# EAGLE schematic Adafruit Speaker Bonnet (EAGLE 6.4)
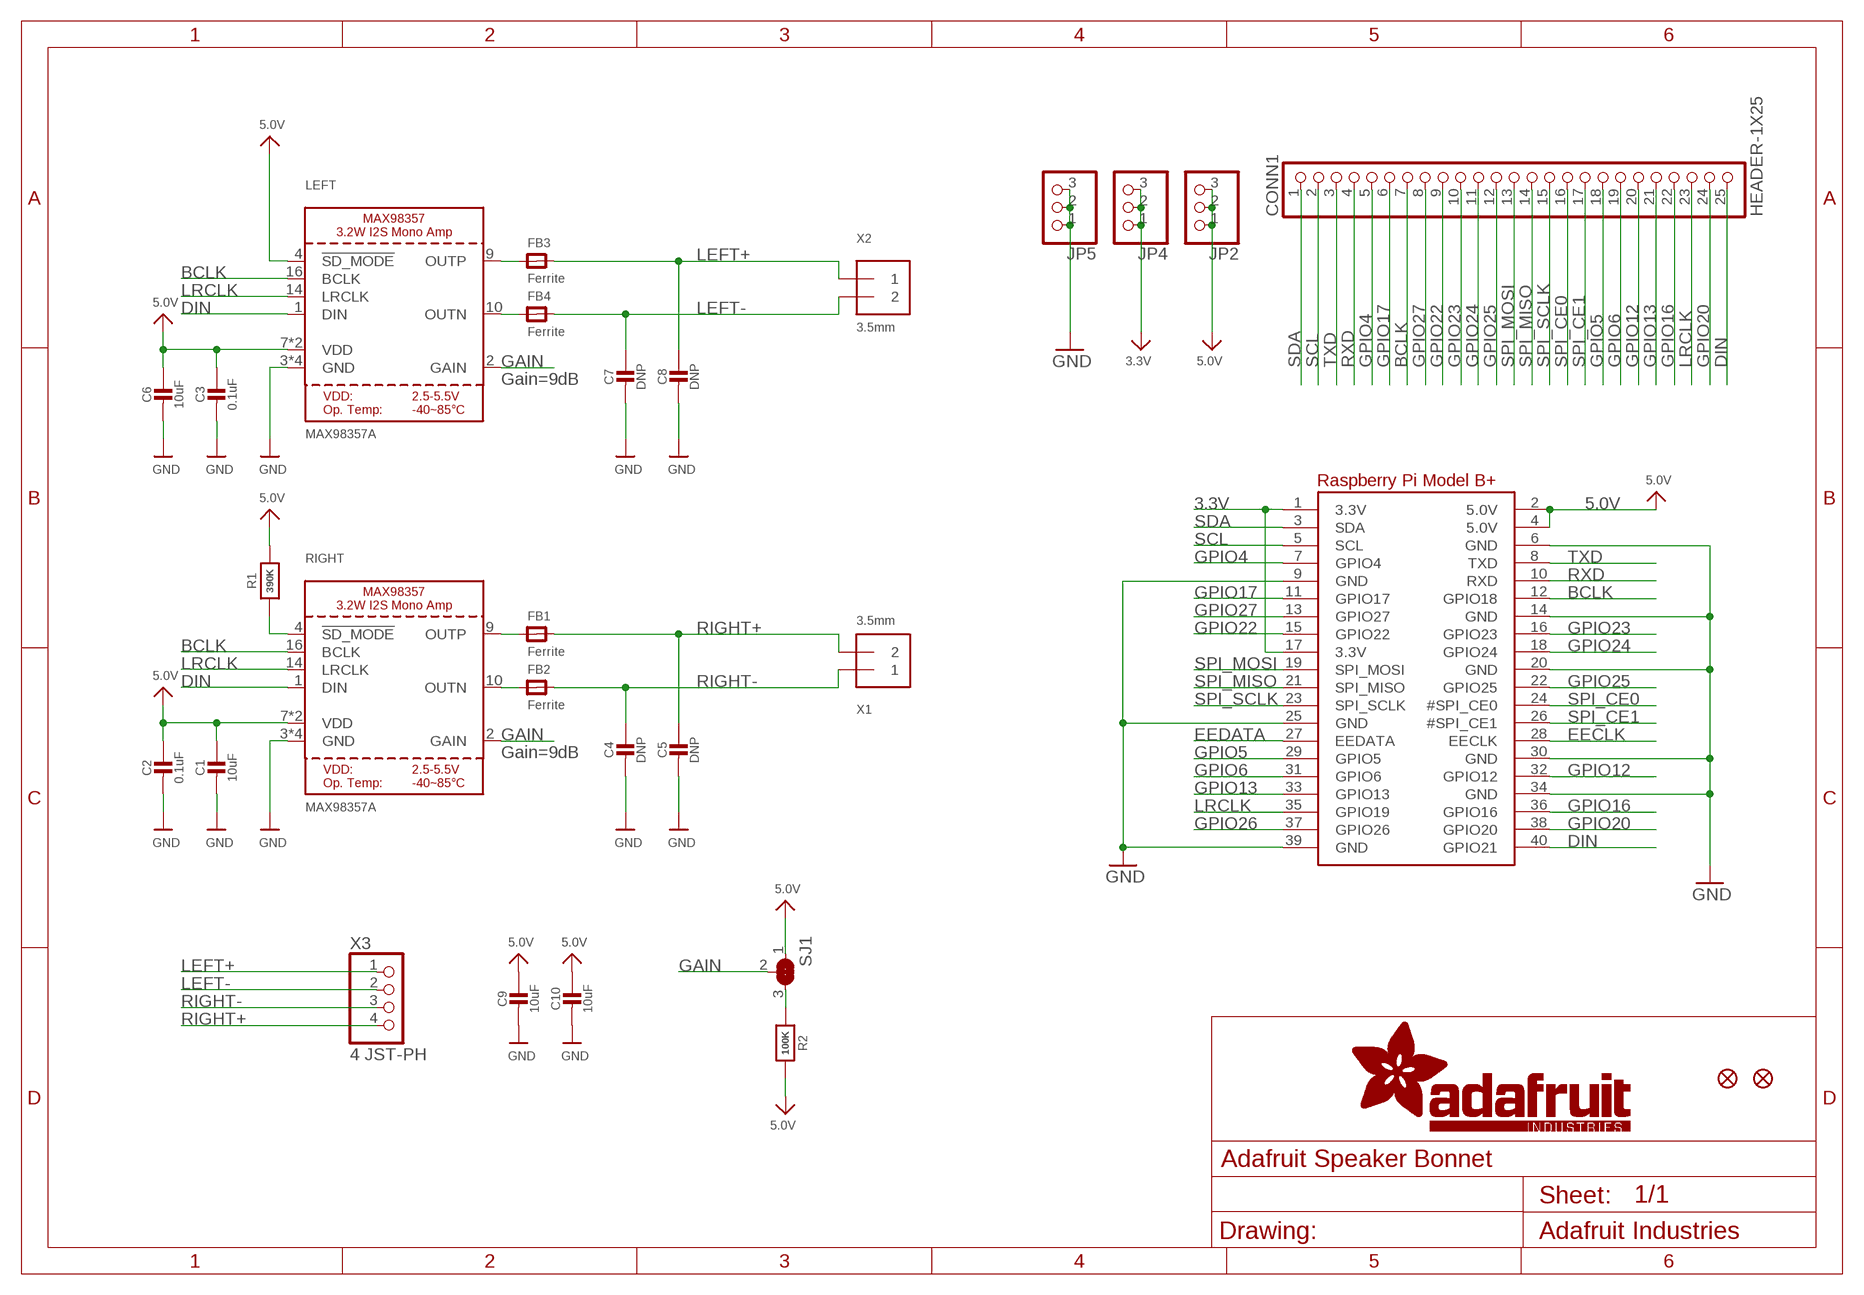
[diagram p0: schematic, sheet 1]

## Parts
C1  10uF  CAP_CERAMIC0805-NOOUTLINE  [0805-NO]
C2  0.1uF  CAP_CERAMIC0805-NOOUTLINE  [0805-NO]
C3  0.1uF  CAP_CERAMIC0805-NOOUTLINE  [0805-NO]
C4  DNP  CAP_CERAMIC0805-NOOUTLINE  [0805-NO]
C5  DNP  CAP_CERAMIC0805-NOOUTLINE  [0805-NO]
C6  10uF  CAP_CERAMIC0805-NOOUTLINE  [0805-NO]
C7  DNP  CAP_CERAMIC0805-NOOUTLINE  [0805-NO]
C8  DNP  CAP_CERAMIC0805-NOOUTLINE  [0805-NO]
C9  10uF  CAP_CERAMIC0805-NOOUTLINE  [0805-NO]
C10  10uF  CAP_CERAMIC0805-NOOUTLINE  [0805-NO]
CONN1  HEADER-1X25  [1X25_ROUND_70MIL]
FB1  Ferrite  FERRITE-0805NO  [0805-NO]
FB2  Ferrite  FERRITE-0805NO  [0805-NO]
FB3  Ferrite  FERRITE-0805NO  [0805-NO]
FB4  Ferrite  FERRITE-0805NO  [0805-NO]
FID1  FIDUCIAL""  [FIDUCIAL_1MM]
FID2  FIDUCIAL""  [FIDUCIAL_1MM]
JP2  HEADER-1X376MIL  [1X03_ROUND_76]
JP4  HEADER-1X376MIL  [1X03_ROUND_76]
JP5  HEADER-1X376MIL  [1X03_ROUND_76]
LEFT  MAX98357A  AUDIOAMP_MAX98357  [QFN16_3MM]
R1  390K  RESISTOR0805_NOOUTLINE  [0805-NO]
R2  100K  RESISTOR0805_NOOUTLINE  [0805-NO]
RIGHT  MAX98357A  AUDIOAMP_MAX98357  [QFN16_3MM]
RPI1  RASPBERRYPI_BPLUS_BONNETNODIM  [PI_BONNET_NODIM]
SJ1  SOLDERJUMPER_2WAY  [SOLDERJUMPER_2WAY_OPEN_NOPASTE]
X1  3.5mm  TERMBLOCK_1X2  [TERMBLOCK_1X2-3.5MM]
X2  3.5mm  TERMBLOCK_1X2  [TERMBLOCK_1X2-3.5MM]
X3  4 JST-PH  CON_JST_PH_4PIN  [JSTPH4]

## Nets
3.3V: JP4.1 JP4.2 JP4.3 RPI1.1(3.3V) RPI1.17(3.3V)
5.0V: C1.1 C2.1 C3.1 C6.1 C9.1 C10.1 JP2.1 JP2.2 JP2.3 LEFT.4(!SD_MODE) LEFT.7(VDD) LEFT.8(VDD) R1.2 R2.2 RIGHT.7(VDD) RIGHT.8(VDD) RPI1.2(5.0V) RPI1.4(5.0V) SJ1.1
BCLK: CONN1.7 LEFT.16(BCLK) RIGHT.16(BCLK) RPI1.12(GPIO18)
DIN: CONN1.25 LEFT.1(DIN) RIGHT.1(DIN) RPI1.40(GPIO21)
EECLK: RPI1.28(EECLK)
EEDATA: RPI1.27(EEDATA)
GAIN: LEFT.2(GAIN) RIGHT.2(GAIN) SJ1.2
GND: C1.2 C2.2 C3.2 C4.2 C5.2 C6.2 C7.2 C8.2 C9.2 C10.2 JP5.1 JP5.2 JP5.3 LEFT.3(GND) LEFT.11(GND) LEFT.15(GND) LEFT.THERMAL(GND) RIGHT.3(GND) RIGHT.11(GND) RIGHT.15(GND) RIGHT.THERMAL(GND) RPI1.6(GND) RPI1.9(GND) RPI1.14(GND) RPI1.20(GND) RPI1.25(GND) RPI1.30(GND) RPI1.34(GND) RPI1.39(GND)
GPIO4: CONN1.5 RPI1.7(GPIO4)
GPIO5: CONN1.18 RPI1.29(GPIO5)
GPIO6: CONN1.19 RPI1.31(GPIO6)
GPIO12: CONN1.20 RPI1.32(GPIO12)
GPIO13: CONN1.21 RPI1.33(GPIO13)
GPIO16: CONN1.22 RPI1.36(GPIO16)
GPIO17: CONN1.6 RPI1.11(GPIO17)
GPIO20: CONN1.24 RPI1.38(GPIO20)
GPIO22: CONN1.9 RPI1.15(GPIO22)
GPIO23: CONN1.10 RPI1.16(GPIO23)
GPIO24: CONN1.11 RPI1.18(GPIO24)
GPIO25: CONN1.12 RPI1.22(GPIO25)
GPIO26: RPI1.37(GPIO26)
GPIO27: CONN1.8 RPI1.13(GPIO27)
LEFT+: C8.1 FB3.2 X2.1 X3.1
LEFT-: C7.1 FB4.2 X2.2 X3.2
LRCLK: CONN1.23 LEFT.14(LRCLK) RIGHT.14(LRCLK) RPI1.35(GPIO19)
N$1: FB4.1 LEFT.10(OUTN)
N$2: FB3.1 LEFT.9(OUTP)
N$5: FB2.1 RIGHT.10(OUTN)
N$6: FB1.1 RIGHT.9(OUTP)
N$7: R2.1 SJ1.3
RIGHT+: C5.1 FB1.2 X1.2 X3.4
RIGHT-: C4.1 FB2.2 X1.1 X3.3
RXD: CONN1.4 RPI1.10(RXD)
SCL: CONN1.2 RPI1.5(SCL)
SD_MODE: R1.1 RIGHT.4(!SD_MODE)
SDA: CONN1.1 RPI1.3(SDA)
SPI_CE0: CONN1.16 RPI1.24(#SPI_CE0)
SPI_CE1: CONN1.17 RPI1.26(#SPI_CE1)
SPI_MISO: CONN1.14 RPI1.21(SPI_MISO)
SPI_MOSI: CONN1.13 RPI1.19(SPI_MOSI)
SPI_SCLK: CONN1.15 RPI1.23(SPI_SCLK)
TXD: CONN1.3 RPI1.8(TXD)

## Notes on the sheet
- Gain=9dB
- Gain=9dB

## Library data of the parts
C1-C10 = microbuilder:CAP_CERAMIC: Ceramic Capacitors For new designs, use the packages preceded by an '_' character since they are more reliable: The following footprints should be used on most boards: _0402 - Standard footprint for regular board layouts _0603 - Standard footprint for regular board layouts _0805 - Standard footprint for regular board layouts _1206 - Standard footprint for regular board layouts For extremely tight-pitch boards where space is at a premium, the following 'micro-pitch' footprints can be used (smaller pads, no silkscreen outline, etc.): _0402MP - Micro-pitch footprint for very dense/compact boards _0603MP - Micro-pitch footprint for very dense/compact boards _0805MP - Micro-pitch footprint for very dense/compact boards _1206MP - Micro-pitch footprint for very dense/compact boards
CONN1 = microbuilder:HEADER-1X25
FB1-FB4 = microbuilder:FERRITE: Ferrite Bead 0603 MMZ1608B121C - 120 Ohm @ 100MHz, 600mA, 0.15 Ohm DC Resistance - Digikey: 445-2164-1-ND BK1608HW121-T - 120 Ohm, 600mA Ferrite Chip - Digikey: 587-1876-2-ND 0805 HZ0805B272R-10 - 2.7K Ohm @ 100MHz, 200mA, 0.8 Ohm DC Resistance - Digikey: 240-2504-1-ND (see also Murata BLM21BD272SN1L) MMZ2012Y152B - 1.5K Ohm @ 100MHz, 500mA, 0.4 Ohm DC Resistance - Digikey: 445-1560-1-ND - Mainly for high frequency (80-400MHz) MMZ2012R102A - 1K Ohm @ 100MHz, 500mA, 0.3 Ohm DC Resistance - Digikey: 445-1555-2-ND - More general purpose (10-200MHz)
FID1 FID2 = microbuilder:FIDUCIAL: Fiducial Alignment Points Various fiducial points for machine vision alignment.; BOM: EXCLUDE
JP2 JP4 JP5 = microbuilder:HEADER-1X3: PIN HEADER
LEFT RIGHT = microbuilder:AUDIOAMP_MAX98357: MAX98357 - 3.2W I2S Mono Audio Amp
R1 R2 = microbuilder:RESISTOR: Resistors For new designs, use the packages preceded by an '_' character since they are more reliable: The following footprints should be used on most boards: _0402 - Standard footprint for regular board layouts _0603 - Standard footprint for regular board layouts _0805 - Standard footprint for regular board layouts _1206 - Standard footprint for regular board layouts For extremely tight-pitch boards where space is at a premium, the following 'micro-pitch' footprints can be used (smaller pads, no silkscreen outline, etc.): _0402MP - Micro-pitch footprint for very dense/compact boards _0603MP - Micro-pitch footprint for very dense/compact boards _0805MP - Micro-pitch footprint for very dense/compact boards _1206MP - Micro-pitch footprint for very dense/compact boards
RPI1 = microbuilder:RASPBERRYPI_BPLUS
SJ1 = microbuilder:SOLDERJUMPER_2WAY: 2-Way Solder Jumper
X1 X2 = microbuilder:TERMBLOCK_1X2: 3.5mm Terminal block http://www.ladyada.net/library/pcb/eaglelibrary.html
X3 = microbuilder:CON_JST_PH_4PIN: JST 4-Pin Right-Angle Connector 4UConnector: 17312